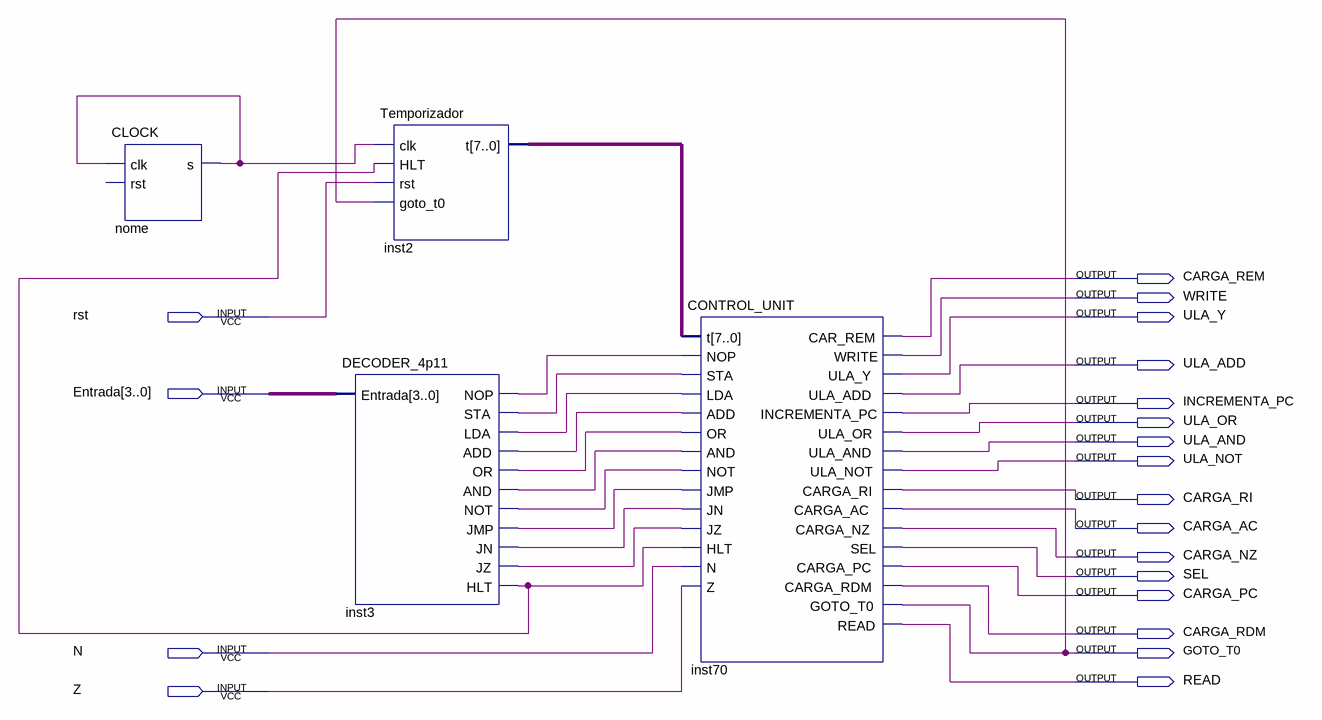
[diagram p0: schematic sheet]
// Quartus schematic LAB07.bdf as structural Verilog: 4 symbols, 20 pins
module LAB07 (
  input  rst,
  input  [3:0] Entrada,
  input  N,
  input  Z,
  output CARGA_REM,
  output WRITE,
  output ULA_Y,
  output ULA_ADD,
  output INCREMENTA_PC,
  output ULA_OR,
  output ULA_AND,
  output ULA_NOT,
  output CARGA_RI,
  output CARGA_AC,
  output CARGA_NZ,
  output SEL,
  output CARGA_PC,
  output CARGA_RDM,
  output GOTO_T0,
  output READ
);

  wire inst3_add, inst3_and, inst3_hlt, inst3_jmp, inst3_jn, inst3_jz, inst3_lda, inst3_nop, inst3_not,
       inst3_or, inst3_sta, nome_s;
  wire [7:0] inst2_t;

  CLOCK nome (.clk(nome_s), .s(nome_s));  // open: rst
  Temporizador inst2 (.clk(nome_s), .HLT(inst3_hlt), .rst(rst), .goto_t0(GOTO_T0), .t(inst2_t));
  DECODER_4p11 inst3 (
    .Entrada(Entrada), .NOP(inst3_nop), .STA(inst3_sta), .LDA(inst3_lda), .ADD(inst3_add), .OR(inst3_or),
    .AND(inst3_and), .NOT(inst3_not), .JMP(inst3_jmp), .JN(inst3_jn), .JZ(inst3_jz), .HLT(inst3_hlt));
  CONTROL_UNIT inst70 (
    .t(inst2_t), .NOP(inst3_nop), .STA(inst3_sta), .LDA(inst3_lda), .ADD(inst3_add), .OR(inst3_or),
    .AND(inst3_and), .NOT(inst3_not), .JMP(inst3_jmp), .JN(inst3_jn), .JZ(inst3_jz), .HLT(inst3_hlt), .N(N),
    .Z(Z), .CAR_REM(CARGA_REM), .WRITE(WRITE), .ULA_Y(ULA_Y), .ULA_ADD(ULA_ADD),
    .INCREMENTA_PC(INCREMENTA_PC), .ULA_OR(ULA_OR), .ULA_AND(ULA_AND), .ULA_NOT(ULA_NOT),
    .CARGA_RI(CARGA_RI), .CARGA_AC(CARGA_AC), .CARGA_NZ(CARGA_NZ), .SEL(SEL), .CARGA_PC(CARGA_PC),
    .CARGA_RDM(CARGA_RDM), .GOTO_T0(GOTO_T0), .READ(READ));
endmodule
